# Altium schematic sheet Power.SchDoc
size 431 x 279 mm; SheetNumber: 4; SheetTotal: 4
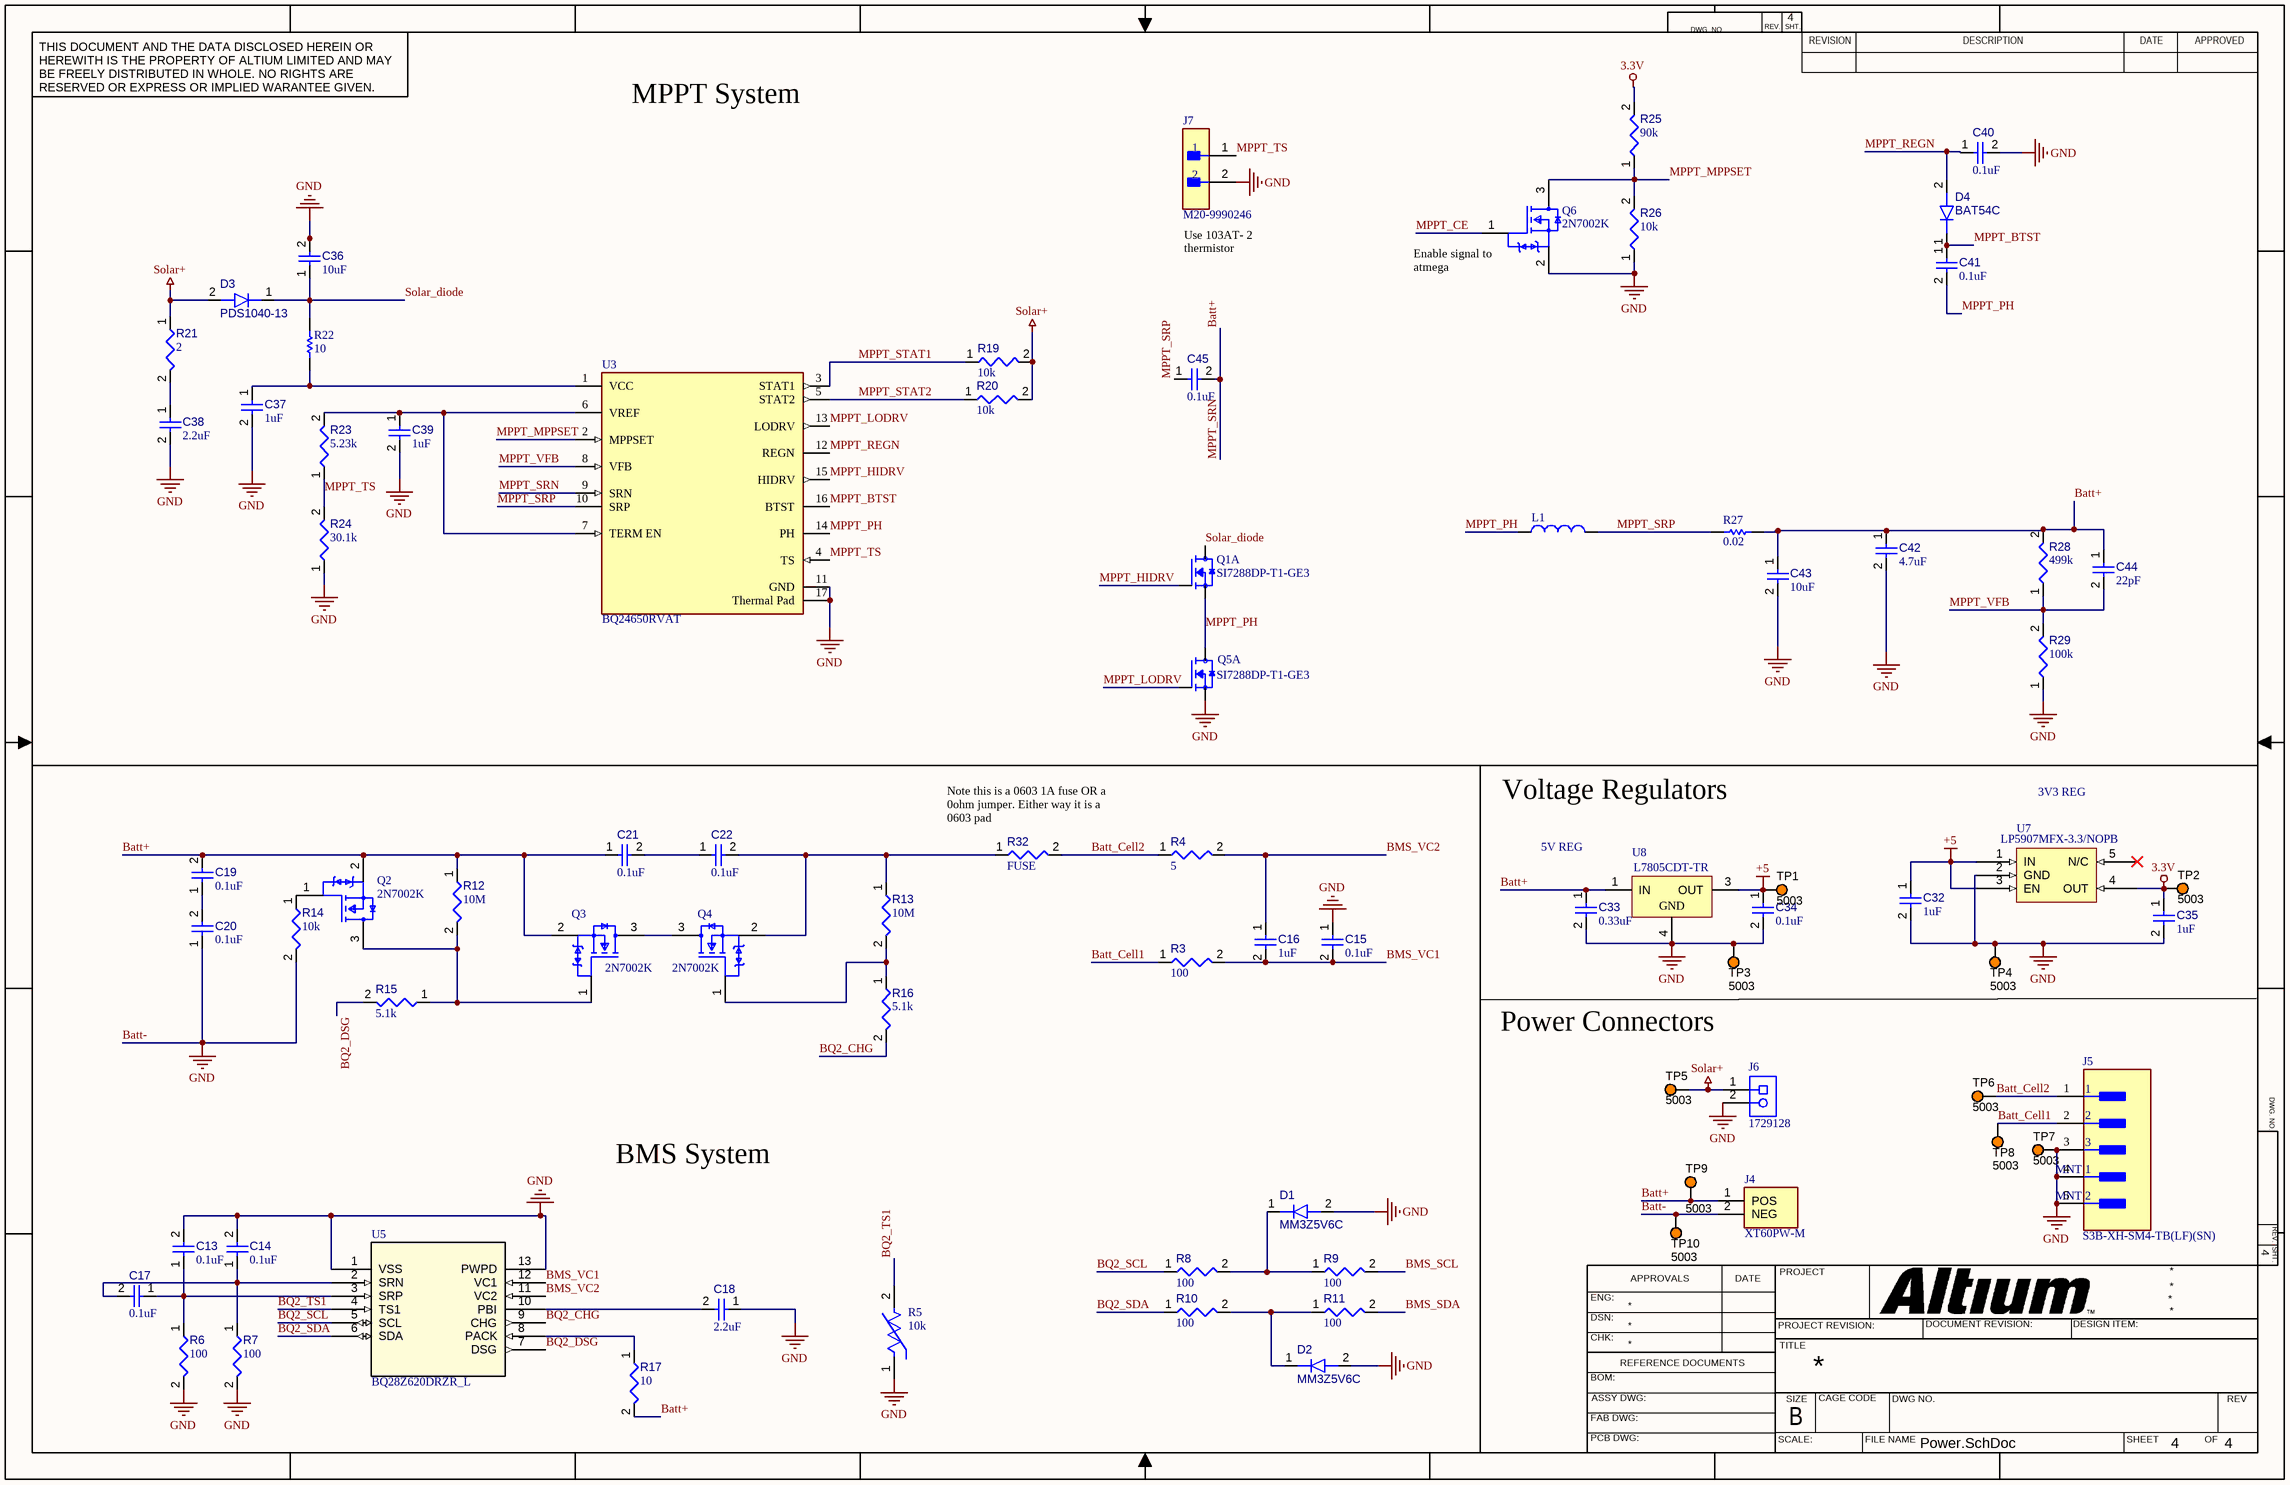
[diagram p0: Power.SchDoc]

## Parts
C13  value 0.1uF  [CAPC1608X90X40NL10T20]  (hidden comment: Capacitor 100 nF +/-10% 50 V 0603)
C14  value 0.1uF  [CAPC1608X90X40NL10T20]  (hidden comment: Capacitor 100 nF +/-10% 50 V 0603)
C15  value 0.1uF  [CAPC1608X90X40NL10T20]  (hidden comment: Capacitor 100 nF +/-10% 50 V 0603)
C16  value 1uF  [CAPC1608X90X40NL10T20]  (hidden comment: Capacitor 100 nF +/-10% 50 V 0603)
C17  value 0.1uF  [CAPC1608X90X40NL10T20]  (hidden comment: Capacitor 100 nF +/-10% 50 V 0603)
C18  value 2.2uF  [CAPC1608X90X40NL10T20]  (hidden comment: Capacitor 100 nF +/-10% 50 V 0603)
C19  value 0.1uF  [CAPC1608X90X40NL10T20]  (hidden comment: Capacitor 100 nF +/-10% 50 V 0603)
C20  value 0.1uF  [CAPC1608X90X40NL10T20]  (hidden comment: Capacitor 100 nF +/-10% 50 V 0603)
C21  value 0.1uF  [CAPC1608X90X40NL10T20]  (hidden comment: Capacitor 100 nF +/-10% 50 V 0603)
C22  value 0.1uF  [CAPC1608X90X40NL10T20]  (hidden comment: Capacitor 100 nF +/-10% 50 V 0603)
C32  value 1uF  [CAPC1608X90X40NL10T20]  (hidden comment: Capacitor 100 nF +/-10% 50 V 0603)
C33  value 0.33uF  [CAPC1608X90X40NL10T20]  (hidden comment: Capacitor 100 nF +/-10% 50 V 0603)
C34  value 0.1uF  [CAPC1608X90X40NL10T20]  (hidden comment: Capacitor 100 nF +/-10% 50 V 0603)
C35  value 1uF  [CAPC1608X90X40NL10T20]  (hidden comment: Capacitor 100 nF +/-10% 50 V 0603)
C36  value 10uF  [FP-CGA6P-IPC_B]  (hidden comment: CGA6M3X7R2E104K200AE)
C37  value 1uF  [CAPC1608X90X40NL10T20]  (hidden comment: Capacitor 100 nF +/-10% 50 V 0603)
C38  value 2.2uF  [FP-CGA6P-IPC_B]  (hidden comment: CGA6M3X7R2E104K200AE)
C39  value 1uF  [CAPC1608X90X40NL10T20]  (hidden comment: Capacitor 100 nF +/-10% 50 V 0603)
C40  value 0.1uF  [CAPC1608X90X40NL10T20]  (hidden comment: Capacitor 100 nF +/-10% 50 V 0603)
C41  value 0.1uF  [CAPC1608X90X40NL10T20]  (hidden comment: Capacitor 100 nF +/-10% 50 V 0603)
C42  value 4.7uF  [FP-CGA6P-IPC_B]  (hidden comment: CGA6M3X7R2E104K200AE)
C43  value 10uF  [FP-CGA6P-IPC_B]  (hidden comment: CGA6M3X7R2E104K200AE)
C44  value 22pF  [CAPC1608X90X40NL10T20]  (hidden comment: Capacitor 100 nF +/-10% 50 V 0603)
C45  value 0.1uF  [CAPC1608X90X40NL10T20]  (hidden comment: Capacitor 100 nF +/-10% 50 V 0603)
D1  MM3Z5V6C  [FP-SOD-323F-MFG]
D2  MM3Z5V6C  [FP-SOD-323F-MFG]
D3  PDS1040-13  [FP-PowerDI5-MFG]
D4  BAT54C  [NXP-SOT23-3_V]
J4  XT60PW-M  [AMASS_XT60PW-M]
J5  S3B-XH-SM4-TB(LF)(SN)  [FP-S3B-XH-SM4-TB_LF_SN-MFG]
J6  1729128  [PHOE-1729128-2_V]
J7  M20-9990246  [FP-M20-9990246-MFG]
L1  IHLP2525CZER100M01  [VISH-IHLP2525C-01_V]  (value not drawn)
Q1  SI7288DP-T1-GE3  [TRANS_SI7288DP-T1-GE3]  (part A of 2)
Q2  2N7002K  [FP-318-08-IPC_C]
Q3  2N7002K  [FP-318-08-IPC_C]
Q4  2N7002K  [FP-318-08-IPC_C]
Q5  SI7288DP-T1-GE3  [TRANS_SI7288DP-T1-GE3]  (part A of 2)
Q6  2N7002K  [FP-318-08-IPC_C]
R3  value 100  [RESC0603(1608)_L]  (hidden comment: Resistor 120R +/-5 % 0603 0.1 W)
R4  value 5  [RESC0603(1608)_L]  (hidden comment: Resistor 120R +/-5 % 0603 0.1 W)
R5  value 10k  [FP-103AT-2-MFG]  (hidden comment: 103AT-2)
R6  value 100  [RESC0603(1608)_L]  (hidden comment: Resistor 120R +/-5 % 0603 0.1 W)
R7  value 100  [RESC0603(1608)_L]  (hidden comment: Resistor 120R +/-5 % 0603 0.1 W)
R8  value 100  [RESC0603(1608)_L]  (hidden comment: Resistor 120R +/-5 % 0603 0.1 W)
R9  value 100  [RESC0603(1608)_L]  (hidden comment: Resistor 120R +/-5 % 0603 0.1 W)
R10  value 100  [RESC0603(1608)_L]  (hidden comment: Resistor 120R +/-5 % 0603 0.1 W)
R11  value 100  [RESC0603(1608)_L]  (hidden comment: Resistor 120R +/-5 % 0603 0.1 W)
R12  value 10M  [RESC0603(1608)_L]  (hidden comment: Resistor 120R +/-5 % 0603 0.1 W)
R13  value 10M  [RESC0603(1608)_L]  (hidden comment: Resistor 120R +/-5 % 0603 0.1 W)
R14  value 10k  [RESC0603(1608)_L]  (hidden comment: Resistor 120R +/-5 % 0603 0.1 W)
R15  value 5.1k  [RESC0603(1608)_L]  (hidden comment: Resistor 120R +/-5 % 0603 0.1 W)
R16  value 5.1k  [RESC0603(1608)_L]  (hidden comment: Resistor 120R +/-5 % 0603 0.1 W)
R17  value 10  [RESC0603(1608)_L]  (hidden comment: Resistor 120R +/-5 % 0603 0.1 W)
R19  value 10k  [RESC0603(1608)_L]  (hidden comment: Resistor 120R +/-5 % 0603 0.1 W)
R20  value 10k  [RESC0603(1608)_L]  (hidden comment: Resistor 120R +/-5 % 0603 0.1 W)
R21  value 2  [FP-CRCW2512-e3-MFG]  (hidden comment: CRCW251291R0JNEG)
R22  value 10  [RESC3116X70X50ML13T20]  (hidden comment: Resistor 0R +/- 0.05% 1206 250 mW)
R23  value 5.23k  [RESC0603(1608)_L]  (hidden comment: Resistor 120R +/-5 % 0603 0.1 W)
R24  value 30.1k  [RESC0603(1608)_L]  (hidden comment: Resistor 120R +/-5 % 0603 0.1 W)
R25  value 90k  [RESC0603(1608)_L]  (hidden comment: Resistor 120R +/-5 % 0603 0.1 W)
R26  value 10k  [RESC0603(1608)_L]  (hidden comment: Resistor 120R +/-5 % 0603 0.1 W)
R27  value 0.02  [RESC3116X70X50ML13T20]  (hidden comment: Resistor 1k +/-1% 1206 250 mW)
R28  value 499k  [RESC0603(1608)_L]  (hidden comment: Resistor 120R +/-5 % 0603 0.1 W)
R29  value 100k  [RESC0603(1608)_L]  (hidden comment: Resistor 120R +/-5 % 0603 0.1 W)
R32  value FUSE  [RESC0603(1608)_L]  (hidden comment: Resistor 120R +/-5 % 0603 0.1 W)
TP1  5003  [KSTN-5003]
TP2  5003  [KSTN-5003]
TP3  5003  [KSTN-5003]
TP4  5003  [KSTN-5003]
TP5  5003  [KSTN-5003]
TP6  5003  [KSTN-5003]
TP7  5003  [KSTN-5003]
TP8  5003  [KSTN-5003]
TP9  5003  [KSTN-5003]
TP10  5003  [KSTN-5003]
U3  BQ24650RVAT  [FP-RVA0016A-IPC_B]
U5  BQ28Z620DRZR_L  [VSON12_DRZ_TEX_L]
U7  LP5907MFX-3.3/NOPB  [FP-DBV0005A-IPC_B]
U8  L7805CDT-TR  [TO-252_L]

## Nets
3.3V: C35.1 R25.2 TP2.1 U7.4(OUT)
+5: C32.1 C34.1 TP1.1 U7.1(IN) U7.3(EN) U8.3(OUT)
Batt-: C13.2 C14.2 C15.1 C18.1 C20.1 C32.2 C33.2 C34.2 C35.2 C36.2 C37.2 C38.2 C39.2 C40.2 C42.2 C43.2 D1.2(A) D2.2(A) J4.2(NEG) J5.3 J5.4(MNT_1) J5.5(MNT_2) J6.2 J7.2 Q5.1(S1) Q6.2(Source) R5.1 R6.2 R7.2 R14.2 R24.1 R26.1 R29.1 TP3.1 TP4.1 TP7.1 TP10.1 U3.11(GND) U3.17(Thermal_Pad) U5.1(VSS) U5.13(PWPD) U7.2(GND) U8.4(GND)  [also labelled GND]
Solar+: D3.2(A) J6.1 R19.2 R20.2 R21.1 TP5.1
Batt+: C19.2 C21.1 C33.1 C42.1 C43.1 C44.1 C45.2 J4.1(POS) Q2.2(Source) Q3.2(Source) R12.1 R17.2 R27.2 R28.2 TP9.1 U3.9(SRN) U8.1(IN)  [also labelled MPPT_SRN]
Batt_Cell1: J5.2 R3.1 TP8.1
Batt_Cell2: J5.1 R4.1 R32.2 TP6.1
BMS_SCL: R9.2
BMS_SDA: R11.2
BMS_VC1: C15.2 C16.2 R3.2 U5.12(VC1)
BMS_VC2: C16.1 R4.2 U5.11(VC2)
BQ2_CHG: R16.2 U5.9(CHG)
BQ2_DSG: R15.2 U5.7(DSG)
BQ2_SCL: R8.1 U5.5(SCL)
BQ2_SDA: R10.1 U5.6(SDA)
BQ2_TS1: R5.2 U5.4(TS1)
MPPT_BTST: C41.1 D4.1(K) U3.16(BTST)
MPPT_CE: Q6.1(Gate)
MPPT_HIDRV: Q1.2(G1) U3.15(HIDRV)
MPPT_LODRV: Q5.2(G1) U3.13(LODRV)
MPPT_MPPSET: Q6.3(Drain) R25.1 R26.2 U3.2(MPPSET)
MPPT_PH: C41.2 L1.1 Q1.1(S1) Q5.7_8_9(D1) U3.14(PH)
MPPT_REGN: C40.1 D4.2(A) U3.12(REGN)
MPPT_SRP: C45.1 L1.2 R27.1 U3.10(SRP)
MPPT_STAT1: R19.1 U3.3(STAT1)
MPPT_STAT2: R20.1 U3.5(STAT2)
MPPT_TS: J7.1 R23.1 R24.2 U3.4(TS)
MPPT_VFB: C44.2 R28.1 R29.2 U3.8(VFB)
Solar_diode: C36.1 D3.1(K) Q1.7_8_9(D1) R22.1
NetC13_1: C13.1 C17.1 R6.1 U5.3(SRP)
NetC14_1: C14.1 C17.2 R7.1 U5.2(SRN)
NetC18_2: C18.2 U5.10(PBI)
NetC19_1: C19.1 C20.2
NetC21_2: C21.2 C22.1
NetC22_2: C22.2 Q4.2(Source) R13.1 R32.1
NetC37_1: C37.1 R22.2 U3.1(VCC)
NetC38_1: C38.1 R21.2
NetC39_1: C39.1 R23.2 U3.6(VREF) U3.7(TERM_EN)
NetD1_1: D1.1(K) R8.2 R9.1
NetD2_1: D2.1(K) R10.2 R11.1
NetQ2_1: Q2.1(Gate) R14.1
NetQ2_3: Q2.3(Drain) Q3.1(Gate) R12.2 R15.1
NetQ3_3: Q3.3(Drain) Q4.3(Drain)
NetQ4_1: Q4.1(Gate) R13.2 R16.1
NetR17_1: R17.1 U5.8(PACK)

Not connected (* = marked no-connect by the designer): U7 5(N/C)*

## Notes on the sheet
- MPPT System
- (near J7) Use 103AT- 2 thermistor
- (near Q6) Enable signal to atmega
- (near R32) Note this is a 0603 1A fuse OR a 0ohm jumper. Either way it is a 0603 pad
- Voltage Regulators
- 3V3 REG
- 5V REG
- Power Connectors
- BMS System
- DWG. NO.
- REV.
- SHT.
- THIS DOCUMENT AND THE DATA DISCLOSED HEREIN OR HEREWITH IS THE PROPERTY OF ALTIUM LIMITED AND MAY BE FREELY DISTRIBUTED IN WHOLE. NO RIGHTS ARE RESERVED OR EXPRESS OR IMPLIED WARANTEE GIVEN.
- REVISION
- DESCRIPTION
- DATE
- APPROVED
- ENG:
- APPROVALS
- PROJECT
- DSN:
- CHK:
- REFERENCE DOCUMENTS
- PROJECT REVISION:
- TITLE
- DOCUMENT REVISION:
- DESIGN ITEM:
- BOM:
- FAB DWG:
- PCB DWG:
- ASSY DWG:
- SCALE:
- SIZE
- B
- CAGE CODE
- FILE NAME
- DWG NO.
- SHEET
- OF
- REV

## Library data of the parts
C13-C22 C32-C35 C37 C39-C41 C44 C45 = CMP-001-00017-6: Chip Capacitor, 100 nF, +/- 10%, 50 V, 0603 (1608 Metric); Voltage Rating: 50V; Capacitor Type: Ceramic; Tolerance: 10%; Mounting Technology: SM; Max Operating Temperature: 125°C; RoHS Compliant: True; Pins: 2; Case/Package: 0603; Min Operating Temperature: -55°C
C36 C38 C42 C43 = CMP-001-00084-1: Ceramic Capacitor, Multilayer, Ceramic, 250V, 10% +Tol, 10% -Tol, X7R, 15% TC, 0.1uF, Surface Mount, 1210; Min Operating Temperature: -55°C; Max Operating Temperature: 125°C; RoHS Compliant: Yes; Capacitor Type: Ceramic; Pins: 2; Mounting Technology: Surface Mount; Case/Package: 1210
D1 D2 = CMP-004-00031-1: Zener Diode, 5.6V V(Z), 5%, 0.2W, Silicon, Unidirectional; RoHS Compliant: Yes; Pins: 2; Max Operating Temperature: 150°C
D3 = CMP-004-00033-1: Rectifier Diode, Schottky, 1 Phase, 1 Element, 10A, 40V V(RRM), Silicon; Forward Voltage: 410mV; Pins: 3; RoHS Compliant: Yes; Min Operating Temperature: -65°C; Max Operating Temperature: 180°C
D4 = CMP-004-00032-1: Rectifier Diode, Schottky, 2 Element, 0.2A, 30V V(RRM), Silicon, TO-236AB; Forward Voltage: 1V; RoHS Compliant: Yes; Max Operating Temperature: 150°C; Pins: 3; Min Operating Temperature: -55°C
J4 = CMP-002-00073-1: Socket, DC supply, male, PIN: 2; MF: AMASS; Source: XT60PW-M.SchLib; Component Type: Standard; Pins: 2; Design Item ID: XT60PW-M; Case/Package: Package; Value: *; Check_prices: https://www.snapeda.com/parts/XT60PW-M/AMASS/view-part/?ref=eda; MP: XT60PW-M; SnapEDA_Link: https://www.snapeda.com/parts/XT60PW-M/AMASS/view-part/?ref=snap; Price: None; Availability: Not in stock
J5 = CMP-002-00074-1: Conn Shrouded Header HDR 3 POS 2.5mm Solder RA Side Entry SMD T/R
J6 = CMP-002-00076-1: Barrier Strip Terminal Block, 13.5A, 1.5mm2, 1 Row(s), 1 Deck(s); Voltage Rating: 400V; RoHS Compliant: Yes; Mounting Technology: Board
J7 = CMP-002-00077-1: Board Connector, 2 Contact(s), 1 Row(s), Male, Straight, 0.1 inch Pitch, Solder Terminal, Locking, Black Insulator; Connector Type: BOARD CONNECTOR; Max Operating Temperature: 105°C; Mounting Technology: Board; RoHS Compliant: Yes; Min Operating Temperature: -40°C
L1 = CMP-006-00021-1: General Purpose Inductor, 10uH, 20%, 1 Element, Composite-Core, SMD, 2525; Max Current Rating: 3A; Min Operating Temperature: -55°C; RoHS Compliant: Yes; Max Operating Temperature: 125°C; Pins: 2; Tolerance: 20%
Q1 Q5 = CMP-027-000000-1: Mosfet Array 2 N-Channel (Dual) 40V 20A 15.6W Surface Mount PowerPAKÂ® SO-8 Dual; MF: Vishay; SnapEDA_Link: https://www.snapeda.com/parts/SI7288DP-T1-GE3/Vishay+Siliconix/view-part/?ref=snap; Source: SI7288DP-T1-GE3.SchLib; Purchase-URL: https://pricing.snapeda.com/search/part/SI7288DP-T1-GE3/?ref=eda; Value: *; Check_prices: https://www.snapeda.com/parts/SI7288DP-T1-GE3/Vishay+Siliconix/view-part/?ref=eda; Pin Count: 6; Design Item ID: SI7288DP-T1-GE3; MP: SI7288DP-T1-GE3; Digi-Key_Part_Number: SI7288DP-T1-GE3TR-ND; Component Type: Standard; Package: SO-8 Vishay
Q2-Q4 Q6 = CMP-013-00035-1: Small Signal Field-Effect Transistor, 0.115A I(D), 60V, 1-Element, N-Channel, Silicon, Metal-oxide Semiconductor FET, TO-236AB; RoHS Compliant: No
R3 R4 R6-R17 R19 R20 R23-R26 R28 R29 R32 = CMP-009-00176-3: Chip Resistor, 120 Ohms, +/-5 %, 0.1 W, -55 to 155 degC, 0603; Power: 100mW; Tolerance: 5%; Max Operating Temperature: 155°C; Pins: 2; Case/Package: 0603; Min Operating Temperature: -55°C
R5 = CMP-009-00177-1: NTC Thermistor, 10000ohm, Through Hole Mount; Power: 10mW; Tolerance: 1%; Pins: 2; Mounting Technology: Through Hole; Min Operating Temperature: -50°C; Max Operating Temperature: 110°C; RoHS Compliant: Yes
R21 = CMP-009-00178-1: Fixed Resistor, Metal Glaze/thick Film, 1W, 91ohm, 500V, 5% +/-Tol, 200ppm/Cel, Surface Mount, 2512; Min Operating Temperature: -55°C; RoHS Compliant: Yes; Max Operating Temperature: 155°C; Tolerance: 5%; Power: 1W; Pins: 2; Mounting Technology: Surface Mount; Case/Package: 2512
R22 = CMP-009-00008-5: Chip Resistor, 0 Ohm, 0.25 W, -55 to 155 degC, 1206 (3216 Metric); Voltage Rating: 200V; Power: 250mW; Pins: 2; Min Operating Temperature: -55°C; Tolerance: 0.05%; RoHS Compliant: True; Max Operating Temperature: 155°C; Mounting Technology: SM; Case/Package: 1206
R27 = CMP-009-00011-5: Chip Resistor, 1 KOhm, +/- 1%, 0.25 W, -55 to 155 degC, 1206 (3216 Metric); Voltage Rating: 200V; Power: 250mW; Max Operating Temperature: 155°C; Mounting Technology: SM; Tolerance: 1%; Case/Package: 1206; RoHS Compliant: True; Min Operating Temperature: -55°C; Pins: 2
TP1-TP10 = CMP-002-00037-2: Test Point, Orange, Height 4.6 mm, Tail Length 3 mm, 1-Pin THD, RoHS; Manufacturer: Keystone; Colour: Orange; Packaging: Bulk; Package Description: 1-Pin Through Hole Device, Dia 2.54 mm; Pins: 1; Package Reference: 5003; Datasheet Version: Jun-15; Case/Package: 5003; Mounting Technology: TH; Connector Type: TestPoint; Diameter: 2.54mm; Contact Material: Bronze; Datasheet URL: http://keyelco.com/userAssets/file/M65p56.pdf; Manufacturer URL: http://www.keyelco.com/; Package Quantity: 10; Contact Plating: Tin; RoHS Compliant: True
U3 = CMP-019-00049-1: Power Supply Support Circuit, Adjustable, 1 Channel, +3.85V, PQCC16; Max Supply Voltage: 28V; Min Supply Voltage: 5V; Max Operating Temperature: 85°C; RoHS Compliant: Yes; Pins: 16; Min Operating Temperature: -40°C; Case/Package: HVQCCN
U5 = CMP-00029-00001-1: No Description Available; Mfr_Name: Texas Instruments; RefDes: RefDes; Source: BQ28Z620DRZR.SchLib; Design Item ID: BQ28Z620DRZR_L; Type: DEV; Manufacturer_Part_Number: BQ28Z620DRZR; Copyright: Copyright (C) 2023 Ultra Librarian. All rights reserved.
U7 = CMP-019-00051-1: Fixed Positive LDO Regulator, 3.3V, 0.25V Dropout, PDSO5; Max Supply Voltage: 5.5V; Pins: 5; RoHS Compliant: Yes; Case/Package: LSSOP
U8 = CMP-019-00050-1: Fixed Positive Standard Regulator, 5VBIPolar, PSSO2; Max Supply Voltage: 25V; Pins: 2; RoHS Compliant: Yes